# Altium schematic sheet Power_FE.SchDoc: PDN - Frontend
size A4; Date: 06.10.2023; ApprovedBy: M.Sc. Tobias Wirth; CheckedBy: M.Sc. Tobias Wirth; Author: M.Sc. Tobias Wirth; CompanyName: University of Stuttgart; DrawnBy: M.Sc. Tobias Wirth; Engineer: M.Sc. Tobias Wirth; Organization: IIS; Address1: Pfaffenwaldring 47; Address2: 70569 Stuttgart; Revision: V0.1; SheetNumber: 17; SheetTotal: 17; ProjectNameAlt: AUS - NMR System; Time: 17:30; ImagePath: N/A; Application_BuildNumber: N/A
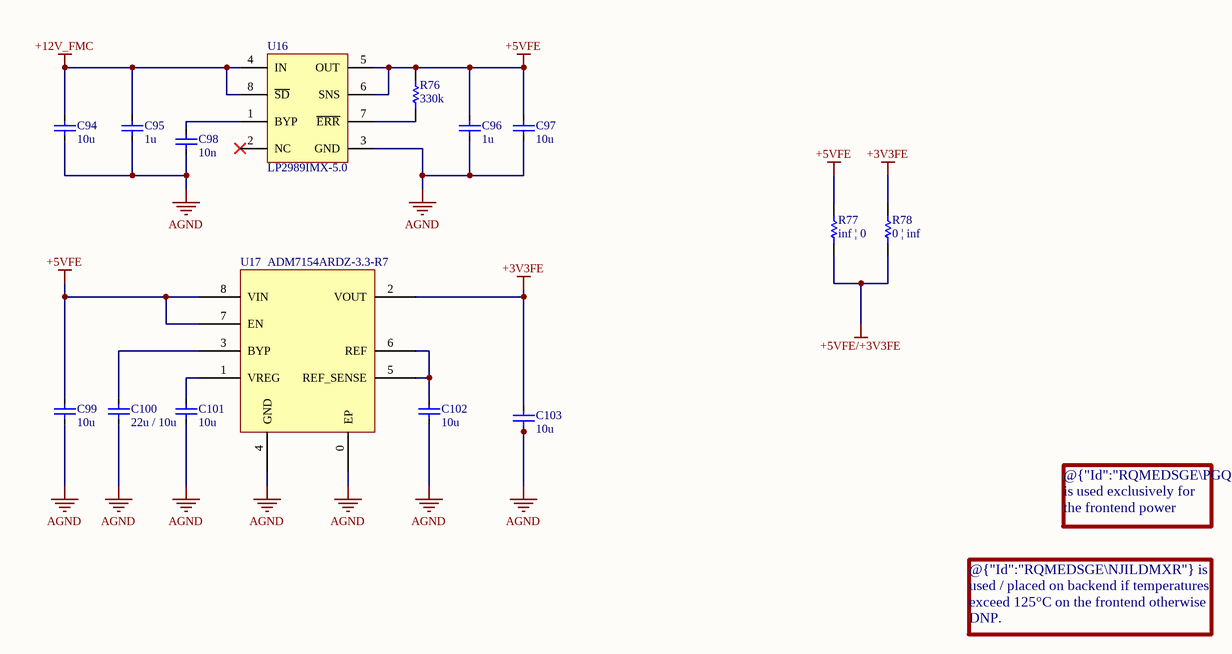
[diagram p0: Power_FE.SchDoc]

## Parts
C94  10u  [CAP_0603]
C95  1u  [CAP_0402]
C96  1u  [CAP_0402]
C97  10u  [CAP_0603]
C98  10n  [CAP_0402]
C99  10u  [CAP_0603]
C100  22u / 10u  [CAP_0603]
C101  10u  [CAP_0603]
C102  10u  [CAP_0603]
C103  10u  [CAP_0603]
R76  330k  [RES_0402]
R77  inf | 0  [RES_0402]
R78  0 | inf  [RES_0402]
U16  LP2989IMX-5.0  [SOP127P600X175-8N]
U17  ADM7154ARDZ-3.3-R7  [SOIC-8_TP - TW]

## Nets
+3V3FE: C103.1 R78.2 U17.2(VOUT)
+5VFE: C96.1 C97.1 C99.1 R76.2 R77.2 U16.5(OUT) U16.6(SNS) U17.7(EN) U17.8(VIN)
+5VFE/+3V3FE: R77.1 R78.1
+12V_FMC: C94.1 C95.1 U16.4(IN) U16.8(~{SD})
AGND: C94.2 C95.2 C96.2 C97.2 C98.2 C99.2 C100.2 C101.2 C102.2 C103.2 U16.3(GND) U17.0(EP) U17.4(GND)
NetC98_1: C98.1 U16.1(BYP)
NetC100_1: C100.1 U17.3(BYP)
NetC101_1: C101.1 U17.1(VREG)
NetC102_1: C102.1 U17.5(REF_SENSE) U17.6(REF)
NetR76_1: R76.1 U16.7(~{ERR})

Not connected (* = marked no-connect by the designer): U16 2(NC)*

## Notes on the sheet
- @{"Id":"RQMEDSGE\PGQLPKLV"} is used exclusively for the frontend power supply
- @{"Id":"RQMEDSGE\NJILDMXR"} is used / placed on backend if temperatures exceed 125°C on the frontend otherwise DNP.
  Also choose @{"Id":"RQMEDSGE\KBXZODYW"} & @{"Id":"RQMEDSGE\DOAMLQUF"} accordingly.
- Title
- Size
- Date:
- Sheet
- A4
- of
- Project
- Drawn By:
- Revision:

## Library data of the parts
C94-C103 = Cap: Supplier: *; Part Number: *
  C94 C97 C99 C101-C103: Value: 10u
  C95 C96: Value: 1u
  C98: Value: 10n
  C100: Value: 22u / 10u
R76-R78 = Res: Part Number: *; Supplier: *
  R76: Value: 330k
  R77: Value: inf | 0
  R78: Value: 0 | inf
U16 = LP2989: Supplier 1: Heisener; Supplier Part Number 1: LP2989IMX-5.0
U17 = ADM715X: Supplier 1: Mouser; Supplier Part Number 1: 584-ADM7154ARDZ3.3R7